# Altium schematic sheet mosfet.SchDoc
size A
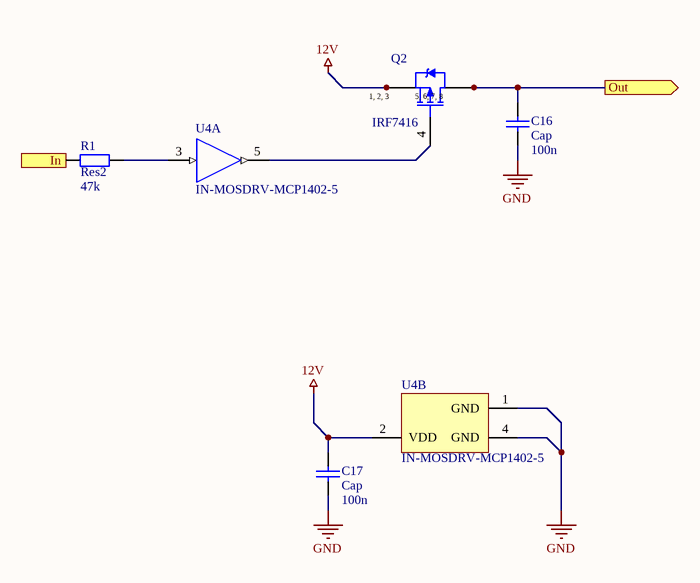
[diagram p0: mosfet.SchDoc]

## Parts
C16  Cap  value 100n  [SMD_Resistor_1206]
C17  Cap  value 100n  [SMD_Resistor_1206]
Q2  IRF7416  [SO-8_L]
R1  Res2  value 47k  [SMD_Resistor_1206]
U4  IN-MOSDRV-MCP1402-5  [SOT-23-OT5_M]  (parts A,B of 2)

## Ports
In (in), Out (out)

## Nets
12V: C17.1 Q2.1(S) Q2.2(S) Q2.3(S) U4.2(VDD)
GND: C16.1 C17.2 U4.1(GND) U4.4(GND)
In: R1.1 ; port In
Out: C16.2 Q2.5(D) Q2.6(D) Q2.7(D) Q2.8(D) ; port Out
NetQ2_4: Q2.4(G) U4.5(OUT)
NetR1_2: R1.2 U4.3(IN)

## Notes on the sheet
- (in symbol IRF7416) 1, 2, 3; 5, 6, 7, 8

## Library data of the parts
C16 C17 = Cap: Capacitor; Published: 8-Jun-2000; LatestRevisionDate: 17-Jul-2002; LatestRevisionNote: Re-released for DXP Platform.; PackageReference: RAD-0.3; Publisher: Altium Limited; PackageDescription: Radial Cap, Thru-Hole; 2 Leads; 0.3 in Pin Spacing
Q2 = IRF7416: HEXFET Power MOSFET; Published: 8-Jun-2000; LatestRevisionDate: 13-Apr-2006; LatestRevisionNote: IPC-7351 Footprint Added.; DatasheetVersion: Aug-1997; PackageVersion: Feb-2001; PackageReference: SO-8; Publisher: Altium Limited; PackageDescription: 8-Pin Plastic Small Outline Integrated Circuit 1.27 mm Pitch; Code_JEDEC: MS-012-AA; Code_IPC: SOIC127P600-8; ComponentLink1Description: Manufacturer Link; ComponentLink1URL: http://www.irf.com/; ComponentLink2Description: Datasheet; ComponentLink2URL: http://www.irf.com/product-info/datasheets/data/irf7416.pdf
R1 = Res2: Resistor; Published: 8-Jun-2000; LatestRevisionDate: 17-Jul-2002; LatestRevisionNote: Re-released for DXP Platform.; PackageReference: AXIAL-0.4; Publisher: Altium Limited; PackageDescription: Axial Device, Thru-Hole; 2 Leads; 0.4 in Pin Spacing